# Altium project TI_PRJ.PrjPcb
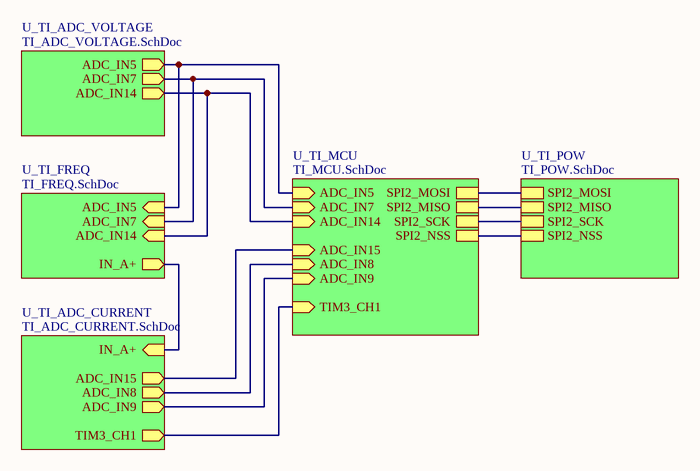
[diagram p0: TI_MAIN.SchDoc]
6 sheets, 95 parts. Net scope: hierarchical (ports join the sheet entries above them; power ports are global).
Board file: TI_PCB.PcbDoc
Sheets:
  TI_MAIN.SchDoc
    U_TI_MCU = TI_MCU.SchDoc
    U_TI_POW = TI_POW.SchDoc
    U_TI_ADC_VOLTAGE = TI_ADC_VOLTAGE.SchDoc
    U_TI_ADC_CURRENT = TI_ADC_CURRENT.SchDoc
    U_TI_FREQ = TI_FREQ.SchDoc

## Sheet TI_MAIN.SchDoc
size A0

### Sub-sheets
U_TI_ADC_CURRENT = TI_ADC_CURRENT.SchDoc: ADC_IN15 (out), IN_A+ (in), TIM3_CH1 (out), ADC_IN8 (out), ADC_IN9 (out)
U_TI_ADC_VOLTAGE = TI_ADC_VOLTAGE.SchDoc: ADC_IN5 (out), ADC_IN7 (out), ADC_IN14 (out)
U_TI_FREQ = TI_FREQ.SchDoc: IN_A+ (out), ADC_IN5 (in), ADC_IN7 (in), ADC_IN14 (in)
U_TI_MCU = TI_MCU.SchDoc: SPI2_MOSI, SPI2_MISO, SPI2_SCK, SPI2_NSS, ADC_IN14 (in), TIM3_CH1 (in), ADC_IN15 (in), ADC_IN8 (in), ADC_IN5 (in), ADC_IN7 (in), ADC_IN9 (in)
U_TI_POW = TI_POW.SchDoc: SPI2_MOSI, SPI2_MISO, SPI2_SCK, SPI2_NSS

### Nets
SPI2_MISO: sheet U_TI_MCU/SPI2_MISO, sheet U_TI_POW/SPI2_MISO
SPI2_MOSI: sheet U_TI_MCU/SPI2_MOSI, sheet U_TI_POW/SPI2_MOSI
SPI2_NSS: sheet U_TI_MCU/SPI2_NSS, sheet U_TI_POW/SPI2_NSS
SPI2_SCK: sheet U_TI_MCU/SPI2_SCK, sheet U_TI_POW/SPI2_SCK
TIM3_CH1: sheet U_TI_MCU/TIM3_CH1, sheet U_TI_ADC_CURRENT/TIM3_CH1
NetC12_2: sheet U_TI_ADC_CURRENT/IN_A+, sheet U_TI_FREQ/IN_A+
NetR5_2: sheet U_TI_MCU/ADC_IN5, sheet U_TI_ADC_VOLTAGE/ADC_IN5, sheet U_TI_FREQ/ADC_IN5
NetR17_2: sheet U_TI_MCU/ADC_IN7, sheet U_TI_ADC_VOLTAGE/ADC_IN7, sheet U_TI_FREQ/ADC_IN7
NetR18_1: sheet U_TI_MCU/ADC_IN14, sheet U_TI_ADC_VOLTAGE/ADC_IN14, sheet U_TI_FREQ/ADC_IN14
NetR35_1: sheet U_TI_MCU/ADC_IN15, sheet U_TI_ADC_CURRENT/ADC_IN15
NetR36_1: sheet U_TI_MCU/ADC_IN8, sheet U_TI_ADC_CURRENT/ADC_IN8
NetR37_1: sheet U_TI_MCU/ADC_IN9, sheet U_TI_ADC_CURRENT/ADC_IN9

## Sheet TI_MCU.SchDoc
size 500 x 500 mm
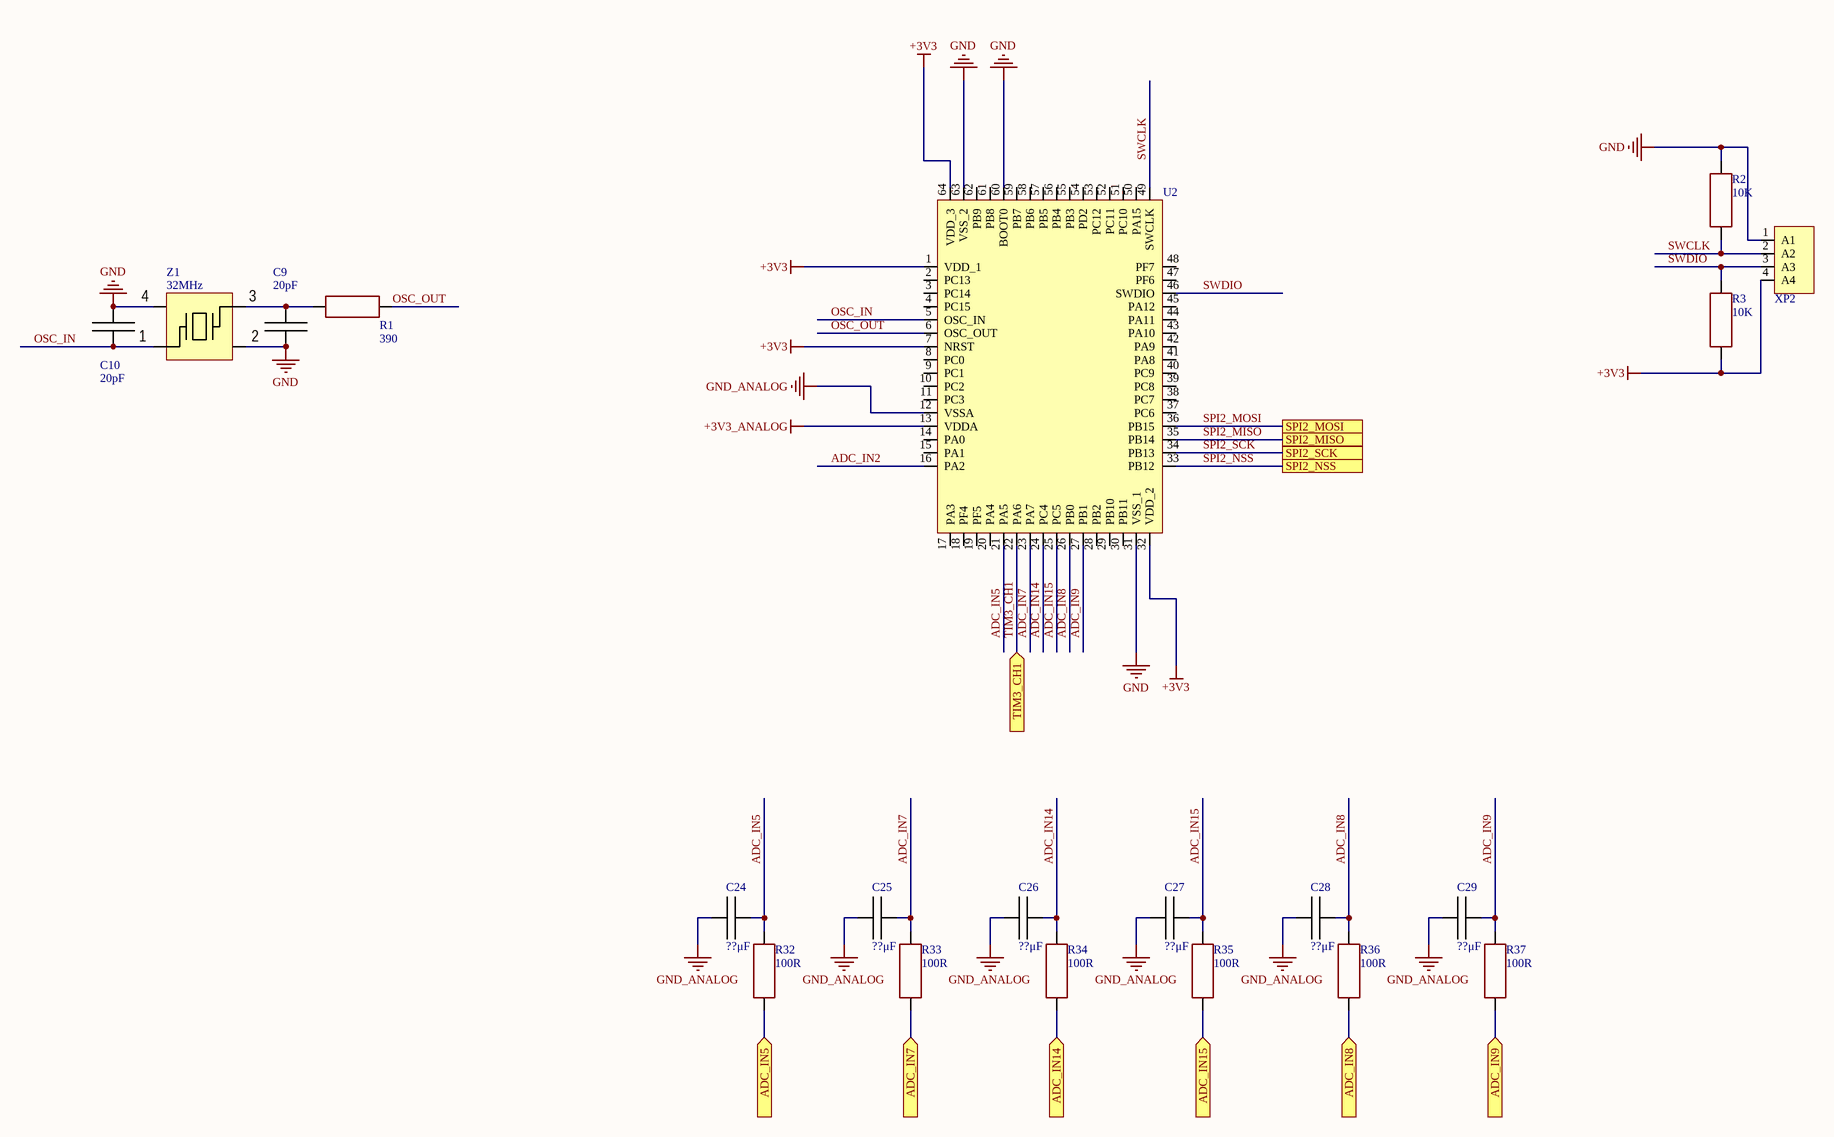
[diagram p1: TI_MCU.SchDoc]

### Parts
C9  value 20pF  [CAP: 0603]  (hidden comment: Cap_0603)
C10  value 20pF  [CAP: 0603]  (hidden comment: Cap_0603)
C24  value ??μF  [CAP: 0603]  (hidden comment: Cap_0603)
C25  value ??μF  [CAP: 0603]  (hidden comment: Cap_0603)
C26  value ??μF  [CAP: 0603]  (hidden comment: Cap_0603)
C27  value ??μF  [CAP: 0603]  (hidden comment: Cap_0603)
C28  value ??μF  [CAP: 0603]  (hidden comment: Cap_0603)
C29  value ??μF  [CAP: 0603]  (hidden comment: Cap_0603)
R1  value 390  [RES: 0603]  (hidden comment: Resistor_0603)
R2  value 10K  [RES: 0603]  (hidden comment: Resistor_0603)
R3  value 10K  [RES: 0603]  (hidden comment: Resistor_0603)
R32  value 100R  [RES: 0603]  (hidden comment: Resistor_0603)
R33  value 100R  [RES: 0603]  (hidden comment: Resistor_0603)
R34  value 100R  [RES: 0603]  (hidden comment: Resistor_0603)
R35  value 100R  [RES: 0603]  (hidden comment: Resistor_0603)
R36  value 100R  [RES: 0603]  (hidden comment: Resistor_0603)
R37  value 100R  [RES: 0603]  (hidden comment: Resistor_0603)
U2  STM32F030R8T6TR  [LQFP-64]  (value not drawn)
XP2  PLS-6 (DS1021-1x6)  [PLS-4 (DS1021-1x4)]  (value not drawn)
Z1  value 32MHz  [OSC: 2520]  (hidden comment: ECS-320-10-36B2-CTN-TR)

### Ports
ADC_IN5 (in), ADC_IN7 (in), ADC_IN8 (in), ADC_IN9 (in), ADC_IN14 (in), ADC_IN15 (in), SPI2_MISO, SPI2_MOSI, SPI2_NSS, SPI2_SCK, TIM3_CH1 (in)

### Nets
+3V3: R3.2 U2.1(VDD_1) U2.7(NRST) U2.32(VDD_2) U2.64(VDD_3) XP2.4(A4)
+3V3_ANALOG: U2.13(VDDA)
GND: C9.1 C10.2 R2.1 U2.31(VSS_1) U2.60(BOOT0) U2.63(VSS_2) XP2.1(A1) Z1.2 Z1.4
GND_ANALOG: C24.1 C25.1 C26.1 C27.1 C28.1 C29.1 U2.12(VSSA)
ADC_IN2: U2.16(PA2)
ADC_IN5: C24.2 R32.2 U2.21(PA5)
ADC_IN7: C25.2 R33.2 U2.23(PA7)
ADC_IN8: C28.2 R36.2 U2.26(PB0)
ADC_IN9: C29.2 R37.2 U2.27(PB1)
ADC_IN14: C26.2 R34.2 U2.24(PC4)
ADC_IN15: C27.2 R35.2 U2.25(PC5)
OSC_IN: C10.1 U2.5(OSC_IN) Z1.1
OSC_OUT: R1.2 U2.6(OSC_OUT)
SPI2_MISO: U2.35(PB14) ; port SPI2_MISO
SPI2_MOSI: U2.36(PB15) ; port SPI2_MOSI
SPI2_NSS: U2.33(PB12) ; port SPI2_NSS
SPI2_SCK: U2.34(PB13) ; port SPI2_SCK
SWCLK: R2.2 U2.49(SWCLK) XP2.2(A2)
SWDIO: R3.1 U2.46(SWDIO) XP2.3(A3)
TIM3_CH1: U2.22(PA6) ; port TIM3_CH1
NetC9_2: C9.2 R1.1 Z1.3
NetR5_2: R32.1 ; port ADC_IN5
NetR17_2: R33.1 ; port ADC_IN7
NetR18_1: R34.1 ; port ADC_IN14
NetR35_1: R35.1 ; port ADC_IN15
NetR36_1: R36.1 ; port ADC_IN8
NetR37_1: R37.1 ; port ADC_IN9

Not connected (* = marked no-connect by the designer): U2 2(PC13) 3(PC14) 4(PC15) 8(PC0) 9(PC1) 10(PC2) 11(PC3) 14(PA0) 15(PA1) 17(PA3) 18(PF4) 19(PF5) 20(PA4) 28(PB2) 29(PB10) 30(PB11) 37(PC6) 38(PC7) 39(PC8) 40(PC9) 41(PA8) 42(PA9) 43(PA10) 44(PA11) 45(PA12) 47(PF6) 48(PF7) 50(PA15) 51(PC10) 52(PC11) 53(PC12) 54(PD2) 55(PB3) 56(PB4) 57(PB5) 58(PB6) 59(PB7) 61(PB8) 62(PB9)

### Library data of the parts
C9 C10 = Cap_0603: TypeDielectric: X7R(X5R); Voltage: 50V; Package/Case: 0603; Temperature: -55...+125°C(-55...+85°C); Product Category: Capacitors
C24-C29 = Cap_0603: TypeDielectric: X7R(X5R); Voltage: ??V; Package/Case: 0603; Temperature: -55...+125°C(-55...+85°C); Product Category: Capacitors
R1-R3 = Resistor_0603: Power: 0.1W; Tolerance: ±1%; Package/Case: 0603; Temperature: -55...+125°C; Product Category: Resistors
R32-R37 = Resistor_0603: Power: 0.1W; Tolerance: ±5%; Package/Case: 0603; Temperature: -55...+125°C; Product Category: Resistors
U2 = STM32F030R8T6TR: MCU Mainstream Arm Cortex-M0 Value line MCU 64 Kbytes of Flash , 48 MHz CPU; Manufacturer: STMicroelectronics; Datasheet: https://www.st.com/resource/en/datasheet/stm32f030r8.pdf; HelpURL: https://eu.mouser.com/ProductDetail/STMicroelectronics/STM32F030R8T6TR?qs=s5SkPsIz10%252B%252B1w15QiyTpQ%3D%3D; Package/Case: LQFP-64; Product Category: Microcontrollers
XP2 = PLS-4 (DS1021-1x4): Board to Board, Surface Mount, Single row, 6 Positions, 2.54mm, Vertical.; Manufacturer: Connfly; Datasheet: https://static.chipdip.ru/lib/977/DOC005977245.pdf; HelpURL: https://www.chipdip.by/product/pls-4; Product Category: Connectors
Z1 = ECS-320-10-36B2-CTN-TR: Crystal 32.000 MHz 10 pF +/-10 +/-20 -40 +85 C +/-2 ppm Max.; Manufacturer: ECS; Package/Case: 2520; HelpURL: https://eu.mouser.com/ProductDetail/ECS/ECS-320-10-36B2-CTN-TR?qs=QNEnbhJQKvbusIFiAH6chw%3D%3D; Temperature: -40...+85°C; Datasheet: https://eu.mouser.com/datasheet/2/122/ECX_2236B2-2400583.pdf; Product Category: Crystals

## Sheet TI_POW.SchDoc
size A0
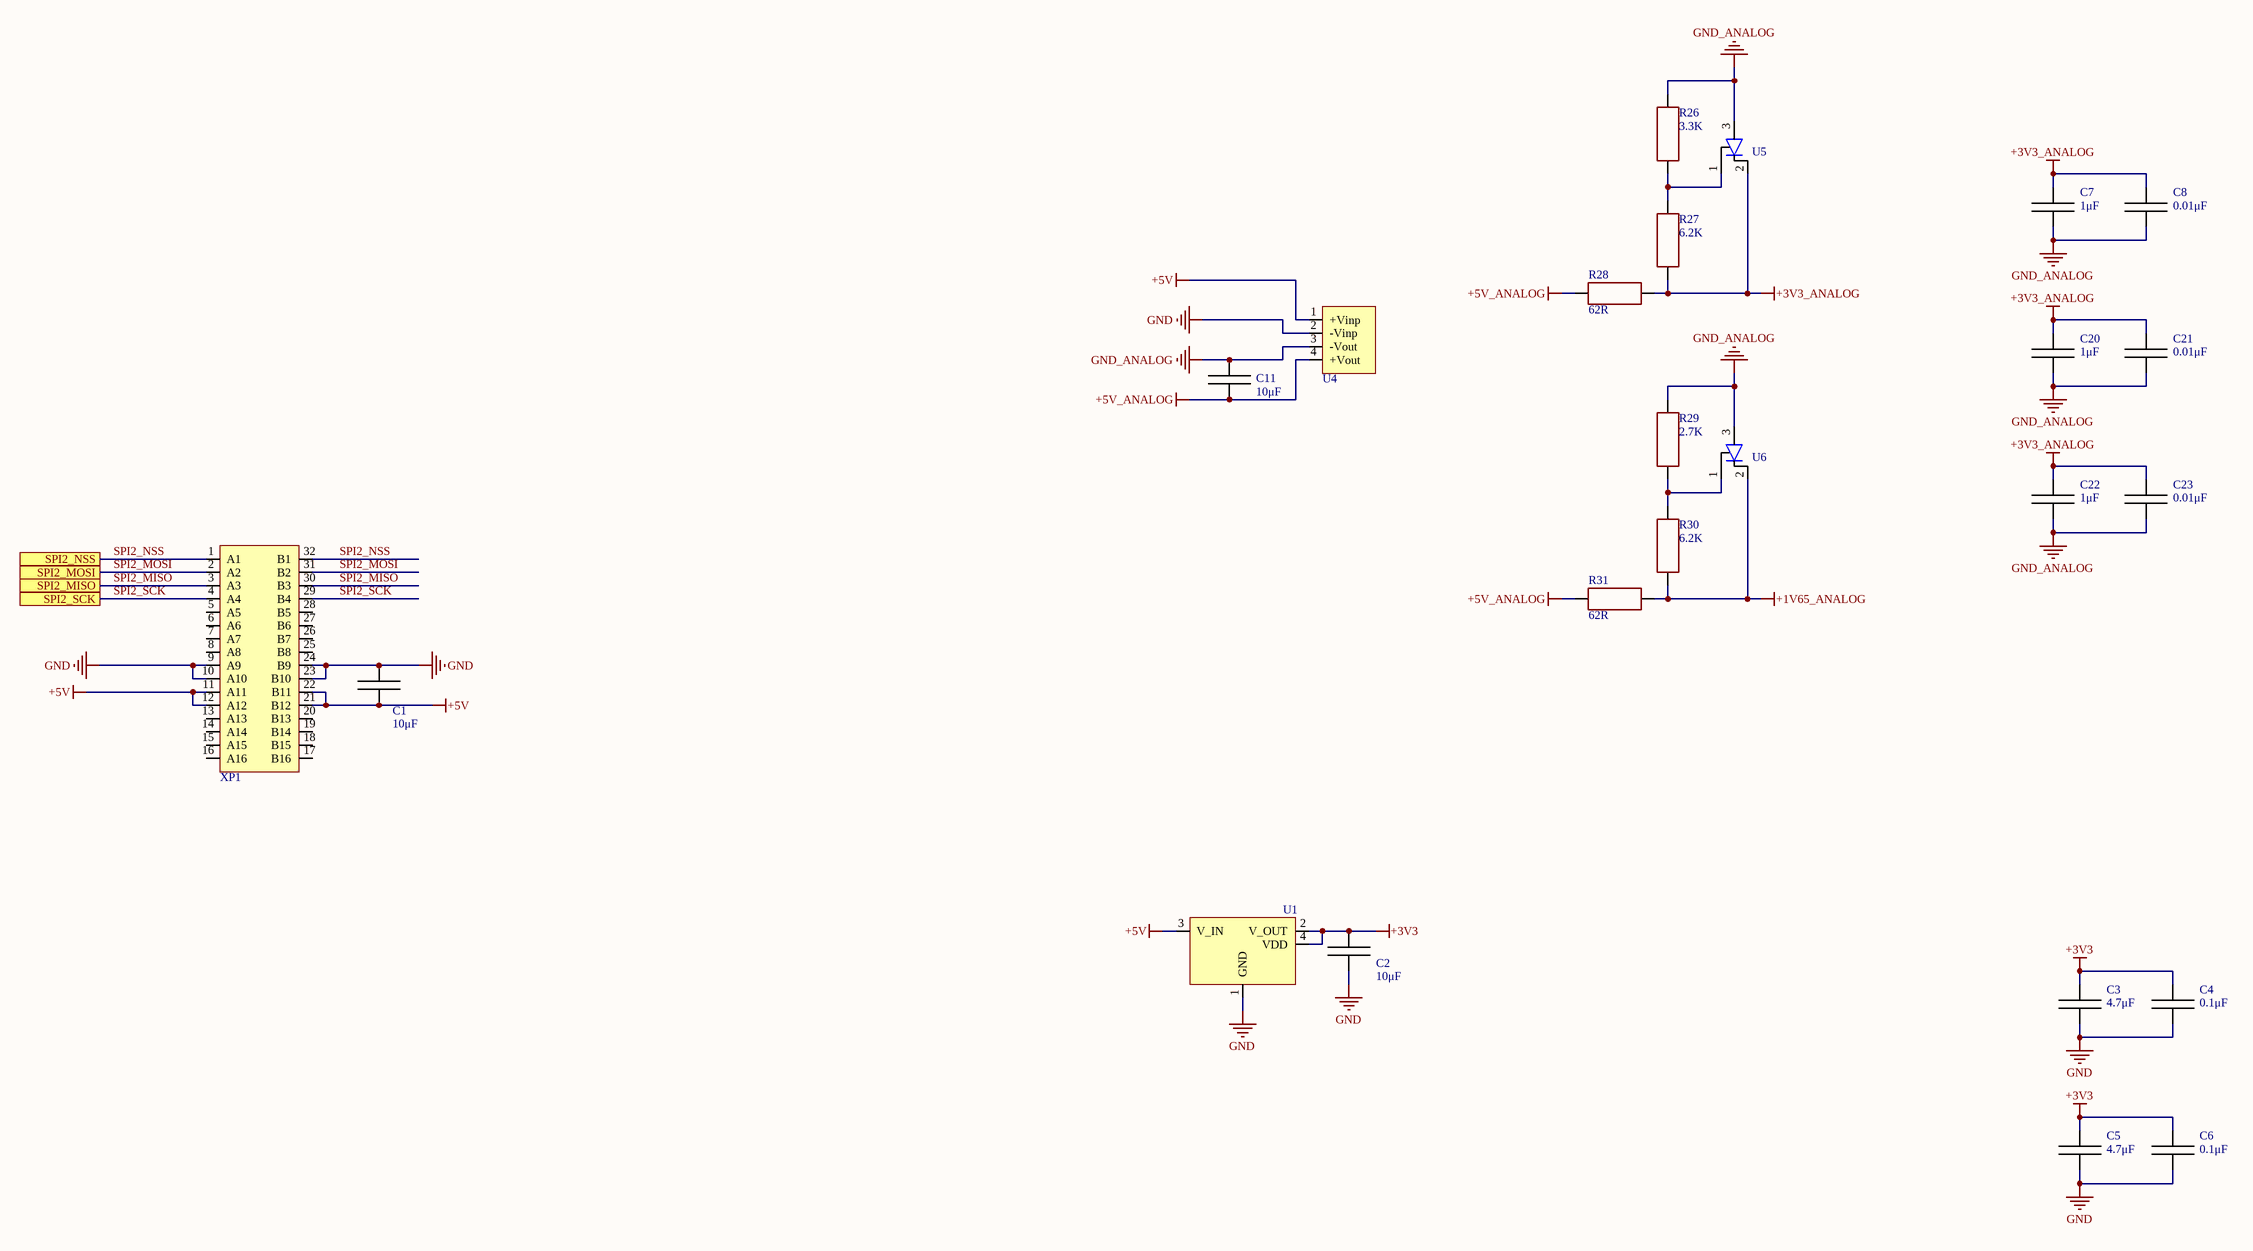
[diagram p2: TI_POW.SchDoc]

### Parts
C1  value 10μF  [CAP: 2220]  (hidden comment: Cap_2220)
C2  value 10μF  [CAP: 2220]  (hidden comment: Cap_2220)
C3  value 4.7μF  [CAP: 0603]  (hidden comment: Cap_0603)
C4  value 0.1μF  [CAP: 0603]  (hidden comment: Cap_0603)
C5  value 4.7μF  [CAP: 0603]  (hidden comment: Cap_0603)
C6  value 0.1μF  [CAP: 0603]  (hidden comment: Cap_0603)
C7  value 1μF  [CAP: 0603]  (hidden comment: Cap_0603)
C8  value 0.01μF  [CAP: 0603]  (hidden comment: Cap_0603)
C11  value 10μF  [CAP: 2220]  (hidden comment: Cap_2220)
C20  value 1μF  [CAP: 0603]  (hidden comment: Cap_0603)
C21  value 0.01μF  [CAP: 0603]  (hidden comment: Cap_0603)
C22  value 1μF  [CAP: 0603]  (hidden comment: Cap_0603)
C23  value 0.01μF  [CAP: 0603]  (hidden comment: Cap_0603)
R26  value 3.3K  [RES: 0603]  (hidden comment: Resistor_0603)
R27  value 6.2K  [RES: 0603]  (hidden comment: Resistor_0603)
R28  value 62R  [RES: 0603]  (hidden comment: Resistor_0603)
R29  value 2.7K  [RES: 0603]  (hidden comment: Resistor_0603)
R30  value 6.2K  [RES: 0603]  (hidden comment: Resistor_0603)
R31  value 62R  [RES: 0603]  (hidden comment: Resistor_0603)
U1  MCP600LD1117S33CTR4  [SOT-223-3]  (value not drawn)
U4  AM1D-0505SZ  [AM1D-0505SZ]  (value not drawn)
U5  TLVH431BIL3T  [SOT-23-3]  (value not drawn)
U6  TLVH431BIL3T  [SOT-23-3]  (value not drawn)
XP1  DS1118-32M-R23  [DS1118-32M-R23]  (value not drawn)

### Ports
SPI2_MISO, SPI2_MOSI, SPI2_NSS, SPI2_SCK

### Nets
+1V65_ANALOG: R30.1 R31.1 U6.2
+3V3: C2.2 C3.2 C4.2 C5.2 C6.2 U1.2(V_OUT) U1.4(VDD)
+3V3_ANALOG: C7.2 C8.2 C20.2 C21.2 C22.2 C23.2 R27.1 R28.1 U5.2
+5V: C1.2 U1.3(V_IN) U4.1(+Vinp) XP1.11(A11) XP1.12(A12) XP1.21(B12) XP1.22(B11)
+5V_ANALOG: C11.1 R28.2 R31.2 U4.4(+Vout)
GND: C1.1 C2.1 C3.1 C4.1 C5.1 C6.1 U1.1(GND) U4.2(-Vinp) XP1.9(A9) XP1.10(A10) XP1.23(B10) XP1.24(B9)
GND_ANALOG: C7.1 C8.1 C11.2 C20.1 C21.1 C22.1 C23.1 R26.2 R29.2 U4.3(-Vout) U5.3 U6.3
SPI2_MISO: XP1.3(A3) XP1.30(B3) ; port SPI2_MISO
SPI2_MOSI: XP1.2(A2) XP1.31(B2) ; port SPI2_MOSI
SPI2_NSS: XP1.1(A1) XP1.32(B1) ; port SPI2_NSS
SPI2_SCK: XP1.4(A4) XP1.29(B4) ; port SPI2_SCK
NetR26_1: R26.1 R27.2 U5.1
NetR29_1: R29.1 R30.2 U6.1

Not connected (* = marked no-connect by the designer): XP1 5(A5) 6(A6) 7(A7) 8(A8) 13(A13) 14(A14) 15(A15) 16(A16) 17(B16) 18(B15) 19(B14) 20(B13) 25(B8) 26(B7) 27(B6) 28(B5)

### Library data of the parts
C1 C2 C11 = Cap_2220: TypeDielectric: X7R(X5R); Voltage: 16V; Package/Case: 2220; Temperature: -55...+125°C(-55...+85°C); Product Category: Capacitors
C3 C5 = Cap_0603: TypeDielectric: X7R(X5R); Voltage: 25V; Package/Case: 0603; Temperature: -55...+125°C(-55...+85°C); Product Category: Capacitors
C4 C6 C7 C20 C22 = Cap_0603: TypeDielectric: X7R(X5R); Voltage: 16V; Package/Case: 0603; Temperature: -55...+125°C(-55...+85°C); Product Category: Capacitors
C8 C21 C23 = Cap_0603: TypeDielectric: X7R(X5R); Voltage: 50V; Package/Case: 0603; Temperature: -55...+125°C(-55...+85°C); Product Category: Capacitors
R26-R31 = Resistor_0603: Power: 0.1W; Tolerance: ±5%; Package/Case: 0603; Temperature: -55...+125°C; Product Category: Resistors
U1 = LD1117S33CTR: LDO Voltage Regulator 3.3V 0.8A Positive; Manufacturer: STMicroelectronics; Datasheet: https://eu.mouser.com/datasheet/2/389/cd00000544-1795431.pdf; HelpURL: https://eu.mouser.com/ProductDetail/STMicroelectronics/LD1117S33CTR?qs=8u%2FLf1IQwKF9meFZLHfRog%3D%3D; Package/Case: SOT-223-3; Product Category: Voltage Regulators
U4 = AM1D-0505SZ: DC-DC, 5V, 0.2A; Manufacturer: Aimtec; Datasheet: https://static.chipdip.ru/lib/744/DOC014744931.pdf; HelpURL: https://www.chipdip.by/product/am1d-0505sz; Package/Case: SIP; Product Category: Voltage Regulators
U5 U6 = TLVH431BIL3T: Voltage References 1.24V to 18V Prog Shunt Ref 100uA 60mA; Manufacturer: STMicroelectronics; Datasheet: https://eu.mouser.com/datasheet/2/389/dm00057412-1797844.pdf; HelpURL: https://eu.mouser.com/ProductDetail/STMicroelectronics/TLVH431BIL3T?qs=NC%2FuX8ipg1S4rbg4USQCPA%3D%3D; Package/Case: SOT-23; Product Category: Voltage References
XP1 = DS1118-32M-R23: DIN 41612 Connector; Manufacturer: Connfly; Analogue: HARTING 09221326951(https://eu.mouser.com/ProductDetail/HARTING/09221326951?qs=Afqhj6cPmO9f0oVZo6yWiA%3D%3D); Datasheet: http://en.connfly.group/static/upload/file/pdf/DS1118.pdf; HelpURL: https://www.chipdip.by/product/din41612r-ds1118-32m-r23; Product Category: Connectors

## Sheet TI_ADC_VOLTAGE.SchDoc
size 500 x 500 mm
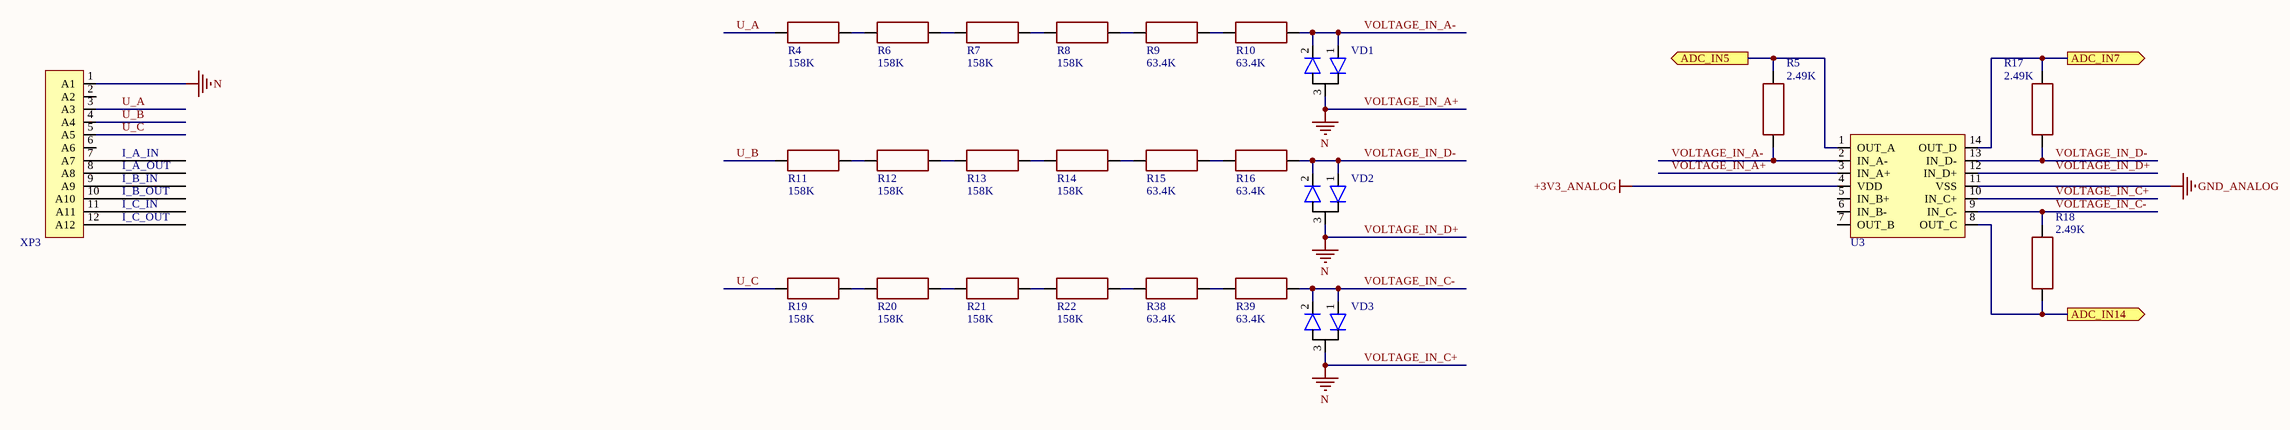
[diagram p3: TI_ADC_VOLTAGE.SchDoc]

### Parts
R4  value 158K  [RES: 0603]  (hidden comment: Resistor_0603)
R5  value 2.49K  [RES: 0603]  (hidden comment: Resistor_0603)
R6  value 158K  [RES: 0603]  (hidden comment: Resistor_0603)
R7  value 158K  [RES: 0603]  (hidden comment: Resistor_0603)
R8  value 158K  [RES: 0603]  (hidden comment: Resistor_0603)
R9  value 63.4K  [RES: 0603]  (hidden comment: Resistor_0603)
R10  value 63.4K  [RES: 0603]  (hidden comment: Resistor_0603)
R11  value 158K  [RES: 0603]  (hidden comment: Resistor_0603)
R12  value 158K  [RES: 0603]  (hidden comment: Resistor_0603)
R13  value 158K  [RES: 0603]  (hidden comment: Resistor_0603)
R14  value 158K  [RES: 0603]  (hidden comment: Resistor_0603)
R15  value 63.4K  [RES: 0603]  (hidden comment: Resistor_0603)
R16  value 63.4K  [RES: 0603]  (hidden comment: Resistor_0603)
R17  value 2.49K  [RES: 0603]  (hidden comment: Resistor_0603)
R18  value 2.49K  [RES: 0603]  (hidden comment: Resistor_0603)
R19  value 158K  [RES: 0603]  (hidden comment: Resistor_0603)
R20  value 158K  [RES: 0603]  (hidden comment: Resistor_0603)
R21  value 158K  [RES: 0603]  (hidden comment: Resistor_0603)
R22  value 158K  [RES: 0603]  (hidden comment: Resistor_0603)
R38  value 63.4K  [RES: 0603]  (hidden comment: Resistor_0603)
R39  value 63.4K  [RES: 0603]  (hidden comment: Resistor_0603)
U3  MCP6004  [SOIC-14]  (value not drawn)
VD1  BAV99  [SOT-23-3]  (value not drawn)
VD2  BAV99  [SOT-23-3]  (value not drawn)
VD3  BAV99  [SOT-23-3]  (value not drawn)
XP3  PLS-6 (DS1MSTB 2,5/12-GF-5,08021-1x6)  [MSTB 2,5/12-GF-5,08]  (value not drawn)

### Ports
ADC_IN5 (out), ADC_IN7 (out), ADC_IN14 (out)

### Nets
+3V3_ANALOG: U3.4(VDD)
GND_ANALOG: U3.11(VSS)
VOLTAGE_IN_A+: U3.3(IN_A+) U3.10(IN_C+) U3.12(IN_D+) VD1.3 VD2.3 VD3.3 XP3.1(A1)  [also labelled N, VOLTAGE_IN_C+, VOLTAGE_IN_D+]
U_A: R4.1 XP3.3(A3)
U_B: R11.1 XP3.4(A4)
U_C: R19.1 XP3.5(A5)
VOLTAGE_IN_A-: R5.1 R10.2 U3.2(IN_A-) VD1.1 VD1.2
VOLTAGE_IN_C-: R18.2 R39.2 U3.9(IN_C-) VD3.1 VD3.2
VOLTAGE_IN_D-: R16.2 R17.1 U3.13(IN_D-) VD2.1 VD2.2
NetR4_2: R4.2 R6.1
NetR5_2: R5.2 U3.1(OUT_A) ; port ADC_IN5
NetR6_2: R6.2 R7.1
NetR7_2: R7.2 R8.1
NetR8_2: R8.2 R9.1
NetR9_2: R9.2 R10.1
NetR11_2: R11.2 R12.1
NetR12_2: R12.2 R13.1
NetR13_2: R13.2 R14.1
NetR14_2: R14.2 R15.1
NetR15_2: R15.2 R16.1
NetR17_2: R17.2 U3.14(OUT_D) ; port ADC_IN7
NetR18_1: R18.1 U3.8(OUT_C) ; port ADC_IN14
NetR19_2: R19.2 R20.1
NetR20_2: R20.2 R21.1
NetR21_2: R21.2 R22.1
NetR22_2: R22.2 R38.1
NetR38_2: R38.2 R39.1

Not connected (* = marked no-connect by the designer): U3 5(IN_B+) 6(IN_B-) 7(OUT_B); XP3 2(A2) 6(A6) 7(A7) 8(A8) 9(A9) 10(A10) 11(A11) 12(A12)

### Notes on the sheet
- (near XP3) I_A_IN
- (near XP3) I_A_OUT
- (near XP3) I_B_IN
- (near XP3) I_B_OUT
- (near XP3) I_C_IN
- (near XP3) I_C_OUT

### Library data of the parts
R4-R22 R38 R39 = Resistor_0603: Power: 0.1W; Tolerance: ±5%; Package/Case: 0603; Temperature: -55...+125°C; Product Category: Resistors
U3 = MCP6004: 1 MHz, Low-Power Op Amp; Manufacturer: Microchip; Datasheet: https://eu.mouser.com/ProductDetail/Microchip-Technology-Atmel/MCP6004-I-SL?qs=n%2FfJlMG9rCZ2%2F%2FCryvZ52w%3D%3D; HelpURL: https://eu.mouser.com/ProductDetail/Microchip-Technology-Atmel/MCP6004-I-SL?qs=n%2FfJlMG9rCZ2%2F%2FCryvZ52w%3D%3D; Package/Case: SOIC-14; Product Category: Operational Amplifiers
VD1-VD3 = BAV99: High-speed switching diode; Manufacturer: Nexperia; Datasheet: https://eu.mouser.com/datasheet/2/916/BAV99_SER-1370693.pdf; HelpURL: https://eu.mouser.com/ProductDetail/Nexperia/BAV99235?qs=me8TqzrmIYWUP4h8SbZlfQ%3D%3D; Package/Case: SOT-23; Product Category: Diodes
XP3 = MSTB 2,5/12-GF-5,08: Surface Mount, Single row, 12 Positions, 5.08mm; Manufacturer: Phoenix contact; Datasheet: https://www.phoenixcontact.com/ru-pc/produkty/korpusnaa-cast-dla-pecatnyh-plat-mstb-25-12-gf-508-1776605; HelpURL: https://www.phoenixcontact.com/ru-pc/produkty/korpusnaa-cast-dla-pecatnyh-plat-mstb-25-12-gf-508-1776605; Product Category: Connectors

## Sheet TI_ADC_CURRENT.SchDoc
size 999 x 999 mm
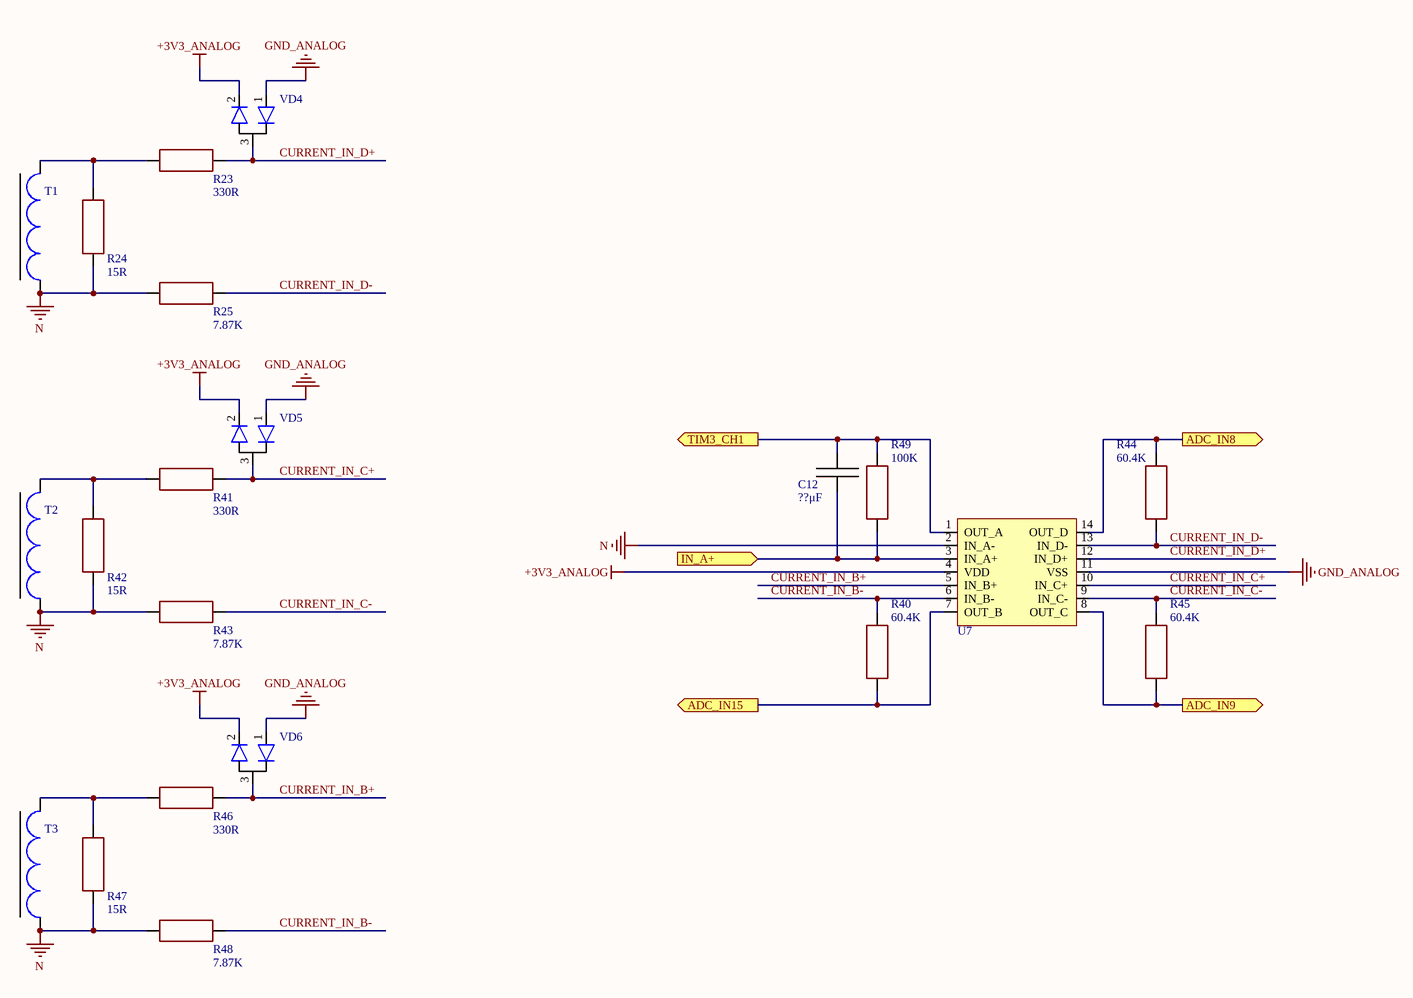
[diagram p4: TI_ADC_CURRENT.SchDoc]

### Parts
C12  value ??μF  [CAP: 0603]  (hidden comment: Cap_0603)
R23  value 330R  [RES: 0603]  (hidden comment: Resistor_0603)
R24  value 15R  [RES: 0603]  (hidden comment: Resistor_0603)
R25  value 7.87K  [RES: 0603]  (hidden comment: Resistor_0603)
R40  value 60.4K  [RES: 0603]  (hidden comment: Resistor_0603)
R41  value 330R  [RES: 0603]  (hidden comment: Resistor_0603)
R42  value 15R  [RES: 0603]  (hidden comment: Resistor_0603)
R43  value 7.87K  [RES: 0603]  (hidden comment: Resistor_0603)
R44  value 60.4K  [RES: 0603]  (hidden comment: Resistor_0603)
R45  value 60.4K  [RES: 0603]  (hidden comment: Resistor_0603)
R46  value 330R  [RES: 0603]  (hidden comment: Resistor_0603)
R47  value 15R  [RES: 0603]  (hidden comment: Resistor_0603)
R48  value 7.87K  [RES: 0603]  (hidden comment: Resistor_0603)
R49  value 100K  [RES: 0603]  (hidden comment: Resistor_0603)
T1  AC-1005  [AC-1005]  (value not drawn)
T2  AC-1005  [AC-1005]  (value not drawn)
T3  AC-1005  [AC-1005]  (value not drawn)
U7  MCP6004  [SOIC-14]  (value not drawn)
VD4  BAV99  [SOT-23-3]  (value not drawn)
VD5  BAV99  [SOT-23-3]  (value not drawn)
VD6  BAV99  [SOT-23-3]  (value not drawn)

### Ports
ADC_IN8 (out), ADC_IN9 (out), ADC_IN15 (out), IN_A+ (in), TIM3_CH1 (out)

### Nets
+3V3_ANALOG: U7.4(VDD) VD4.2 VD5.2 VD6.2
GND_ANALOG: U7.11(VSS) VD4.1 VD5.1 VD6.1
N: R24.1 R25.1 R42.1 R43.1 R47.1 R48.1 T1.1 T2.1 T3.1 U7.2(IN_A-)  [project net VOLTAGE_IN_A+]
CURRENT_IN_B+: R46.2 U7.5(IN_B+) VD6.3
CURRENT_IN_B-: R40.2 R48.2 U7.6(IN_B-)
CURRENT_IN_C+: R41.2 U7.10(IN_C+) VD5.3
CURRENT_IN_C-: R43.2 R45.2 U7.9(IN_C-)
CURRENT_IN_D+: R23.2 U7.12(IN_D+) VD4.3
CURRENT_IN_D-: R25.2 R44.1 U7.13(IN_D-)
TIM3_CH1: C12.1 R49.2 U7.1(OUT_A) ; port TIM3_CH1
NetC12_2: C12.2 R49.1 U7.3(IN_A+) ; port IN_A+
NetR23_1: R23.1 R24.2 T1.2
NetR35_1: R40.1 U7.7(OUT_B) ; port ADC_IN15
NetR36_1: R44.2 U7.14(OUT_D) ; port ADC_IN8
NetR37_1: R45.1 U7.8(OUT_C) ; port ADC_IN9
NetR41_1: R41.1 R42.2 T2.2
NetR46_1: R46.1 R47.2 T3.2

### Library data of the parts
C12 = Cap_0603: TypeDielectric: X7R(X5R); Voltage: ??V; Package/Case: 0603; Temperature: -55...+125°C(-55...+85°C); Product Category: Capacitors
R23-R25 R40-R49 = Resistor_0603: Power: 0.1W; Tolerance: ±5%; Package/Case: 0603; Temperature: -55...+125°C; Product Category: Resistors
T1-T3 = AC-1005: Current Transformer, primary current: 5A; Manufacturer: Talema; Analogue: CST-1005(https://eu.mouser.com/datasheet/2/410/CST_1005-1892657.pdf); Datasheet: https://static.chipdip.ru/lib/884/DOC003884697.pdf; HelpURL: https://www.chipdip.ru/product/ac-1005; Product Category: Current Transformers
U7 = MCP6004: as U3 on sheet TI_ADC_VOLTAGE; Datasheet: https://eu.mouser.com/ProductDetail/Microchip-Technology-Atmel/MCP6004-I-SL?qs=n%2FfJlMG9rCZ2%2F%2FCryvZ52w%3D%3D; HelpURL: https://eu.mouser.com/ProductDetail/Microchip-Technology-Atmel/MCP6004-I-SL?qs=n%2FfJlMG9rCZ2%2F%2FCryvZ52w%3D%3D; Package/Case: SOIC-14; Product Category: Operational Amplifiers
VD4-VD6 = BAV99: as VD1 on sheet TI_ADC_VOLTAGE; Datasheet: https://eu.mouser.com/datasheet/2/916/BAV99_SER-1370693.pdf; HelpURL: https://eu.mouser.com/ProductDetail/Nexperia/BAV99235?qs=me8TqzrmIYWUP4h8SbZlfQ%3D%3D; Package/Case: SOT-23; Product Category: Diodes

## Sheet TI_FREQ.SchDoc
size A4
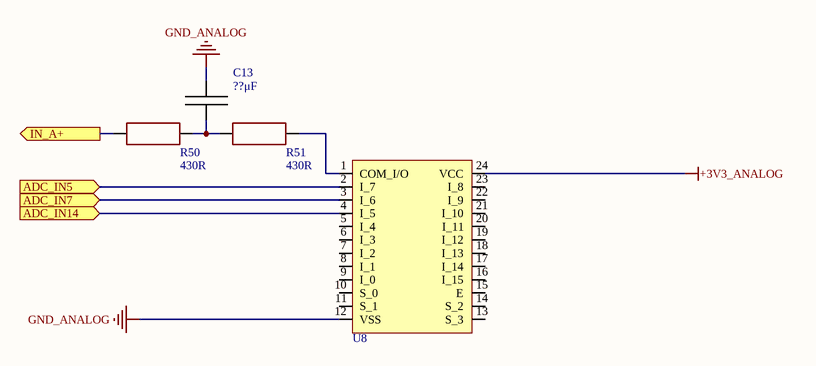
[diagram p5: TI_FREQ.SchDoc]

### Parts
C13  value ??μF  [CAP: 0603]  (hidden comment: Cap_0603)
R50  value 430R  [RES: 0603]  (hidden comment: Resistor_0603)
R51  value 430R  [RES: 0603]  (hidden comment: Resistor_0603)
U8  CD74HC4067M96  [SOIC-24]  (value not drawn)

### Ports
ADC_IN5 (in), ADC_IN7 (in), ADC_IN14 (in), IN_A+ (out)

### Nets
+3V3_ANALOG: U8.24(VCC)
GND_ANALOG: C13.2 U8.12(VSS)
NetC12_2: R50.1 ; port IN_A+
NetC13_1: C13.1 R50.2 R51.1
NetR5_2: U8.2(I_7) ; port ADC_IN5
NetR17_2: U8.3(I_6) ; port ADC_IN7
NetR18_1: U8.4(I_5) ; port ADC_IN14
NetR51_2: R51.2 U8.1(COM_I/O)

Not connected (* = marked no-connect by the designer): U8 5(I_4) 6(I_3) 7(I_2) 8(I_1) 9(I_0) 10(S_0) 11(S_1) 13(S_3) 14(S_2) 15(E) 16(I_15) 17(I_14) 18(I_13) 19(I_12) 20(I_11) 21(I_10) 22(I_9) 23(I_8)

### Library data of the parts
C13 = Cap_0603: TypeDielectric: X7R(X5R); Voltage: ??V; Package/Case: 0603; Temperature: -55...+125°C(-55...+85°C); Product Category: Capacitors
R50 R51 = Resistor_0603: Power: 0.1W; Tolerance: ±5%; Package/Case: 0603; Temperature: -55...+125°C; Product Category: Resistors
U8 = CD74HC4067M96: 1 MHz, Low-Power Op Amp; Manufacturer: Texas Instruments; Datasheet: https://www.ti.com/general/docs/suppproductinfo.tsp?distId=26&gotoUrl=https://www.ti.com/lit/gpn/cd74hct4067; HelpURL: https://eu.mouser.com/ProductDetail/Texas-Instruments/CD74HC4067M96?qs=xFfolx0DHx0XT7d9xTTZBA%3D%3D; Package/Case: SOIC-24; Product Category: Multiplexers

## Nets that join several sheets
+3V3: TI_MCU (6 pins), TI_POW (7 pins)
+3V3_ANALOG: TI_MCU (U2.13), TI_POW (9 pins), TI_ADC_VOLTAGE (U3.4), TI_ADC_CURRENT (U7.4 VD4.2 VD5.2 VD6.2), TI_FREQ (U8.24)
GND: TI_MCU (9 pins), TI_POW (12 pins)
GND_ANALOG: TI_MCU (7 pins), TI_POW (12 pins), TI_ADC_VOLTAGE (U3.11), TI_ADC_CURRENT (U7.11 VD4.1 VD5.1 VD6.1), TI_FREQ (C13.2 U8.12)
VOLTAGE_IN_A+: TI_ADC_VOLTAGE (7 pins), TI_ADC_CURRENT (10 pins)
NetC12_2: TI_ADC_CURRENT (C12.2 R49.1 U7.3), TI_FREQ (R50.1)
NetR5_2: TI_MCU (R32.1), TI_ADC_VOLTAGE (R5.2 U3.1), TI_FREQ (U8.2)
NetR17_2: TI_MCU (R33.1), TI_ADC_VOLTAGE (R17.2 U3.14), TI_FREQ (U8.3)
NetR18_1: TI_MCU (R34.1), TI_ADC_VOLTAGE (R18.1 U3.8), TI_FREQ (U8.4)
NetR35_1: TI_MCU (R35.1), TI_ADC_CURRENT (R40.1 U7.7)
NetR36_1: TI_MCU (R36.1), TI_ADC_CURRENT (R44.2 U7.14)
NetR37_1: TI_MCU (R37.1), TI_ADC_CURRENT (R45.1 U7.8)
SPI2_MISO: TI_MCU (U2.35), TI_POW (XP1.3 XP1.30)
SPI2_MOSI: TI_MCU (U2.36), TI_POW (XP1.2 XP1.31)
SPI2_NSS: TI_MCU (U2.33), TI_POW (XP1.1 XP1.32)
SPI2_SCK: TI_MCU (U2.34), TI_POW (XP1.4 XP1.29)
TIM3_CH1: TI_MCU (U2.22), TI_ADC_CURRENT (C12.1 R49.2 U7.1)